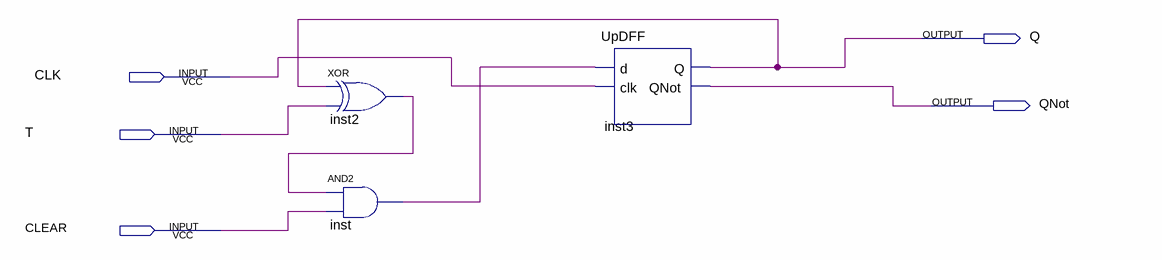
[diagram p0: schematic sheet]
// Quartus schematic MainTFF.bdf as structural Verilog: 3 symbols, 5 pins
module MainTFF (
  input  CLK,
  input  T,
  input  CLEAR,
  output Q,
  output QNot
);

  wire inst2_out, inst_out;

  xor inst2 (inst2_out, Q, T);
  and inst (inst_out, inst2_out, CLEAR);
  UpDFF inst3 (.d(inst_out), .clk(CLK), .Q(Q), .QNot(QNot));
endmodule
